# Altium project GPS_Tracker.PrjPcb
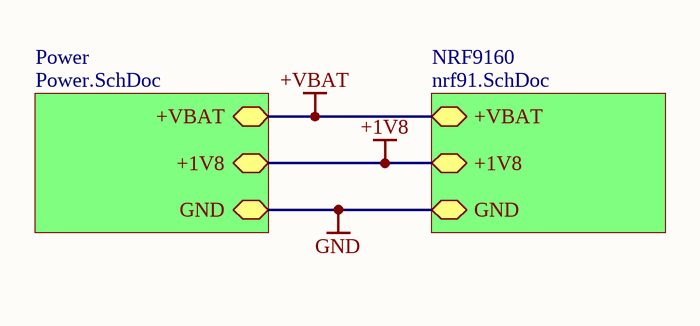
[diagram p0: Main.SchDoc]
3 sheets, 80 parts. Net scope: hierarchical (ports join the sheet entries above them; power ports are global).
Board file: GPS.PcbDoc
Sheets:
  Main.SchDoc
    NRF9160 = nrf91.SchDoc
    Power = Power.SchDoc

## Sheet Main.SchDoc: param:Title
size A4; Author: param:Autor; Wersja: param:Wersja

### Sub-sheets
NRF9160 = nrf91.SchDoc: GND (bidir), +VBAT (bidir), +1V8 (bidir)
Power = Power.SchDoc: GND (bidir), +VBAT (bidir), +1V8 (bidir)

### Nets
+1V8: sheet NRF9160/+1V8, sheet Power/+1V8
+VBAT: sheet NRF9160/+VBAT, sheet Power/+VBAT
GND: sheet NRF9160/GND, sheet Power/GND

### Notes on the sheet
- Project:
- Copyright
- ©
- AMC
- Designers:
- Subject:
- Variant:
- Data:
- Version:
- Sheet:
- /

## Sheet nrf91.SchDoc: param:Title
size A3; Author: param:Autor; Wersja: param:Wersja
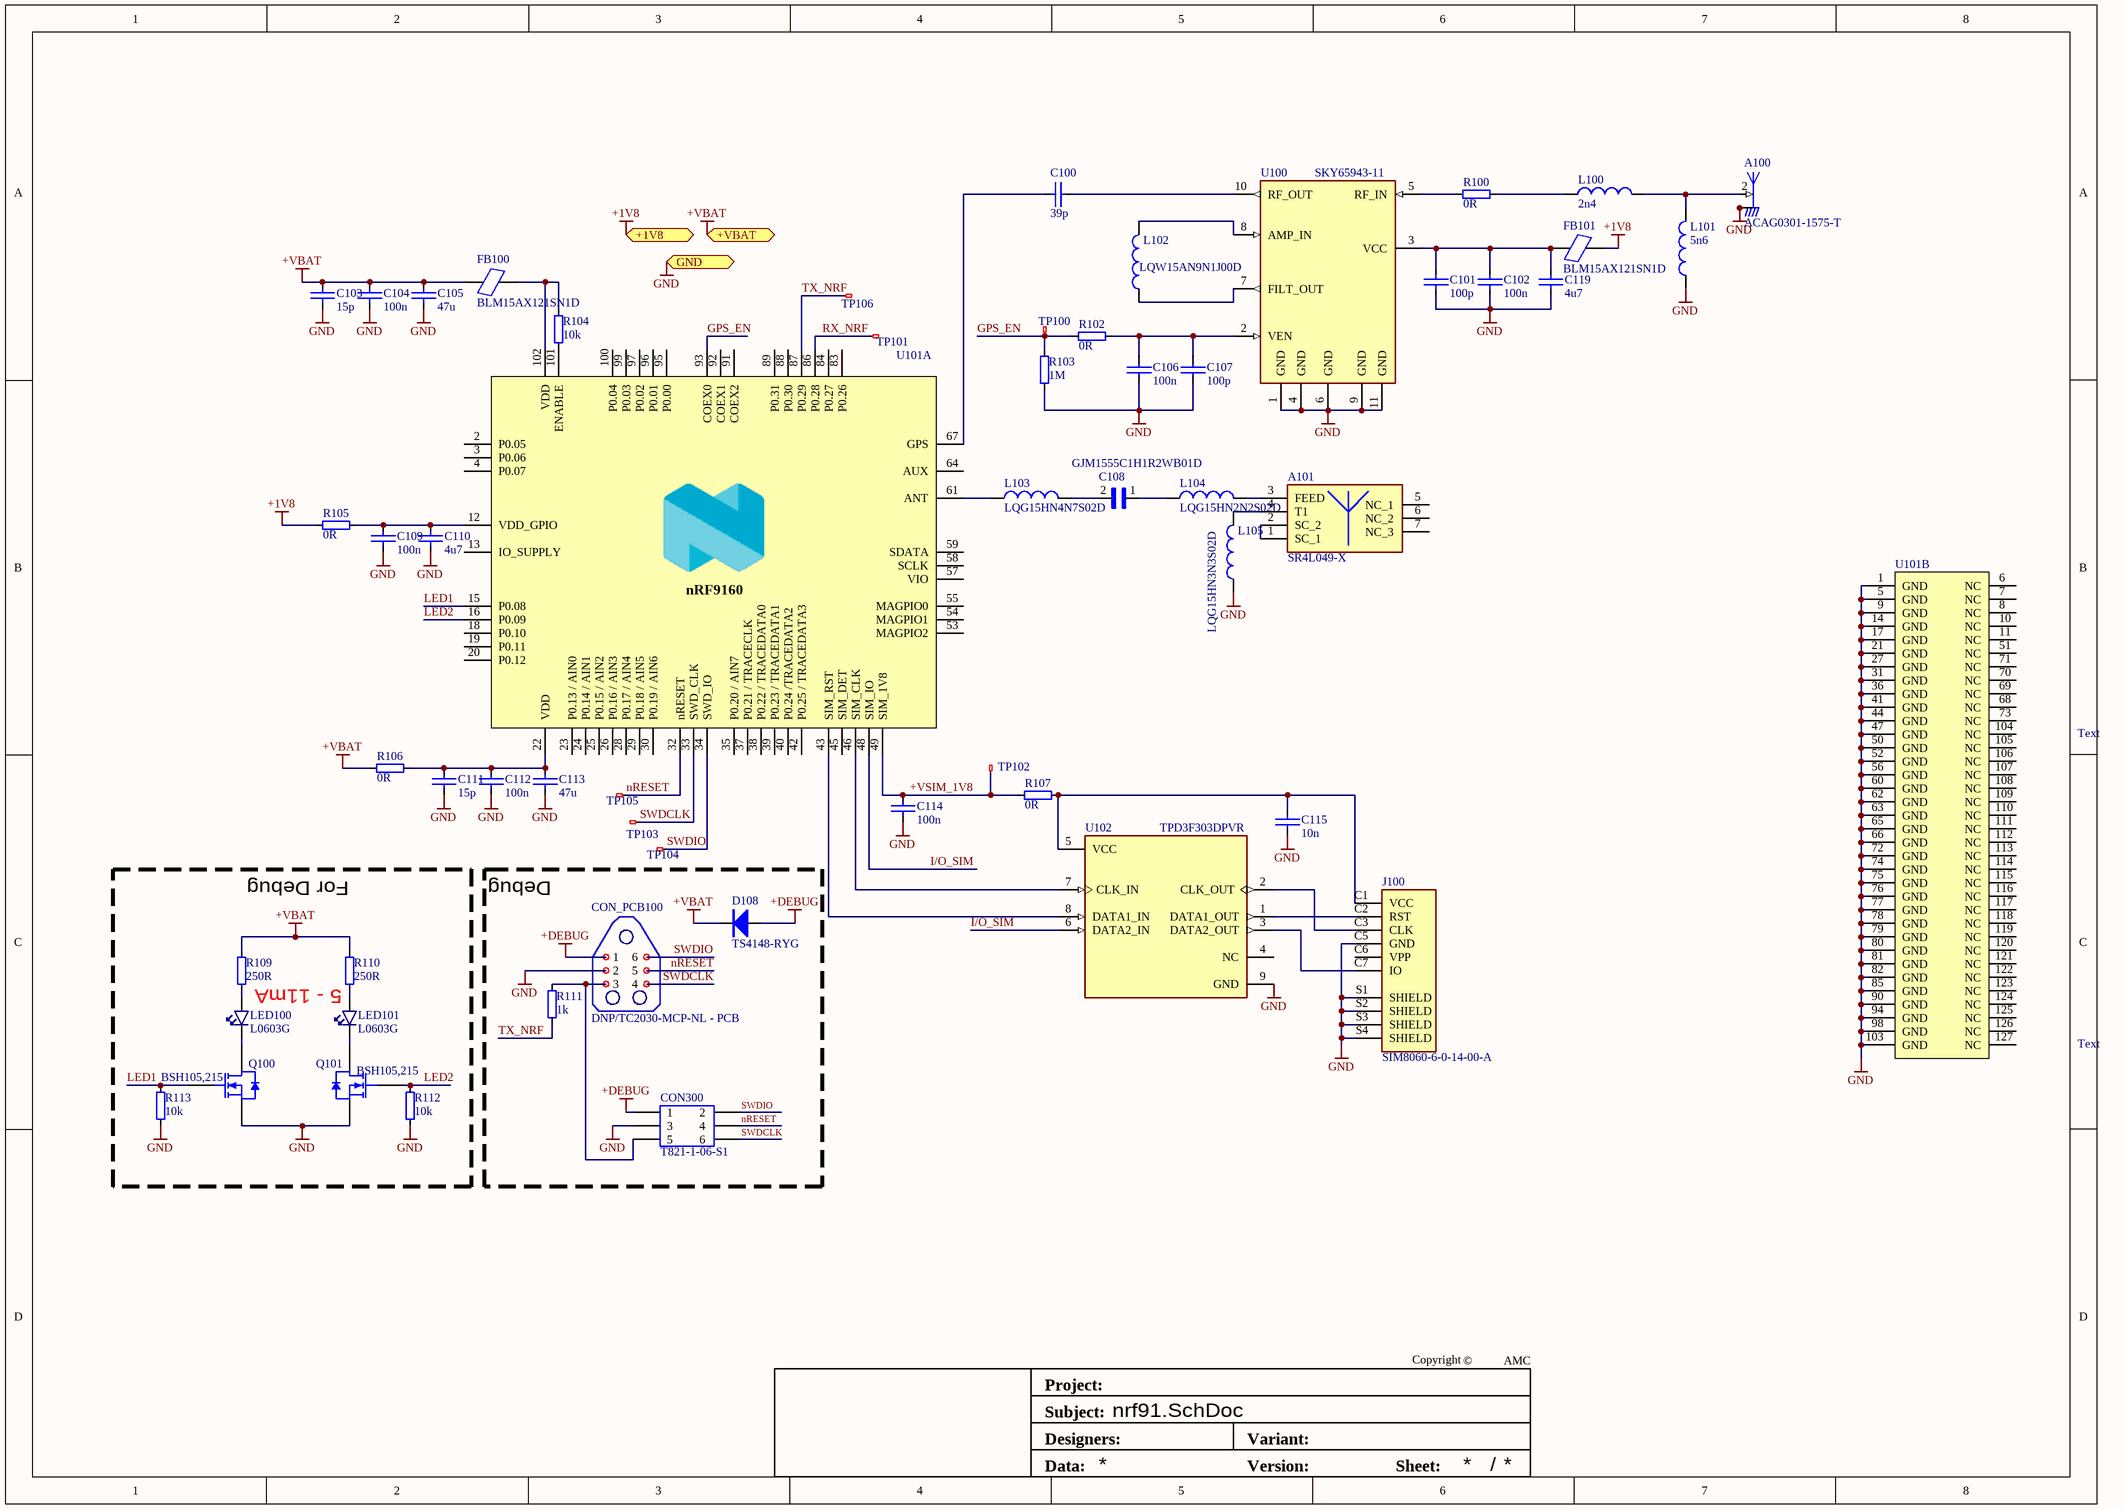
[diagram p1: nrf91.SchDoc]

### Parts
A100  ACAG0301-1575-T  [ANT_ACAG0301-1575-T]
A101  SR4L049-X  [SR4L049R]
C100  39p  [0402_C]
C101  100p  [0402_C]
C102  100n  [0402_C]
C103  15p  [0402_C]
C104  100n  [0402_C]
C105  47u  [0805_c]
C106  100n  [0402_C]
C107  100p  [0402_C]
C108  GJM1555C1H1R2WB01D  [CAPC1005X55N]
C109  100n  [0402_C]
C110  4u7  [0603_C]
C111  15p  [0402_C]
C112  100n  [0402_C]
C113  47u  [0805_c]
C114  100n  [0402_C]
C115  10n  [0402_C]
C119  4u7  [0603_C]
CON300  T821-1-06-S1  [IDC_2X3_2.54MM]
CON_PCB100  DNP/TC2030-MCP-NL - PCB  [TC2030-MCP-NL - PCB]
D108  TS4148-RYG  [0805D]
FB100  BLM15AX121SN1D  [0402_L]
FB101  BLM15AX121SN1D  [0402_L]
J100  SIM8060-6-0-14-00-A  [GCT_SIM8060-6-0-14-00-A]
L100  2n4  [0402]
L101  5n6  [0402]
L102  LQW15AN9N1J00D  [INDC1006X60N]
L103  LQG15HN4N7S02D  [INDC1005X55N]
L104  LQG15HN2N2S02D  [INDC1005X55N]
L105  LQG15HN3N3S02D  [INDC1005X55N]
LED100  L0603G  [LED_0603_G]
LED101  L0603G  [LED_0603_G]
Q100  BSH105,215  [SOT23-3D]
Q101  BSH105,215  [SOT23-3D]
R100  0R  [0402_r]
R102  0R  [0603]
R103  1M  [0603]
R104  10k  [0603]
R105  0R  [0603]
R106  0R  [0603]
R107  0R  [0603]
R109  250R  [0603]
R110  250R  [0603]
R111  1k  [0603]
R112  10k  [0603]
R113  10k  [0603]
TP100  testpointMini  [testpoint_50mils_round]  (value not drawn)
TP101  testpointMini  [testpoint_50mils_round]  (value not drawn)
TP102  testpointMini  [testpoint_50mils_round]  (value not drawn)
TP103  testpointMini  [testpoint_50mils_round]  (value not drawn)
TP104  testpointMini  [testpoint_50mils_round]  (value not drawn)
TP105  testpointMini  [testpoint_50mils_round]  (value not drawn)
TP106  testpointMini  [testpoint_50mils_round]  (value not drawn)
U100  SKY65943-11  [IC_SKY65943-11]
U101  (no value)  [nRF9160_SIP]  (parts A,B of 2)
U102  TPD3F303DPVR  [SON50P210X160X65-9N]

### Ports
+1V8 (bidir), +VBAT (bidir), GND (bidir)

### Nets
+1V8: FB101.2 R105.2 ; port +1V8
+DEBUG: CON300.1 CON_PCB100.1 D108.2
+VBAT: C103.2 C104.2 C105.2 D108.1 FB100.1 R106.2 R109.1 R110.1 ; port +VBAT
GND: A100.1 A100.3 C101.1 C102.1 C103.1 C104.1 C105.1 C106.1 C107.1 C109.1 C110.1 C111.1 C112.1 C113.1 C114.2 C115.1 C119.1 CON300.3 CON_PCB100.2 J100.C5(GND) J100.S1(SHIELD) J100.S2(SHIELD) J100.S3(SHIELD) J100.S4(SHIELD) L101.1 L105.1 Q100.2(S) Q101.2(S) R103.1 R112.2 R113.2 U100.1(GND) U100.4(GND) U100.6(GND) U100.9(GND) U100.11(GND) U101.1(GND) U101.5(GND) U101.9(GND) U101.14(GND) U101.17(GND) U101.21(GND) U101.27(GND) U101.31(GND) U101.36(GND) U101.41(GND) U101.44(GND) U101.47(GND) U101.50(GND) U101.52(GND) U101.56(GND) U101.60(GND) U101.62(GND) U101.63(GND) U101.65(GND) U101.66(GND) U101.72(GND) U101.74(GND) U101.75(GND) U101.76(GND) U101.77(GND) U101.78(GND) U101.79(GND) U101.80(GND) U101.81(GND) U101.82(GND) U101.85(GND) U101.90(GND) U101.94(GND) U101.98(GND) U101.103(GND) U102.9(GND) ; port GND
+VSIM_1V8: C114.1 R107.1 TP102.1 U101.49(SIM_1V8)
GPS_EN: R102.2 R103.2 TP100.1 U101.93(COEX0)
I/O_SIM: U101.48(SIM_IO) U102.6(DATA2_IN)
LED1: Q100.1(G) R113.1 U101.15(P0.08)
LED2: Q101.1(G) R112.1 U101.16(P0.09)
nRESET: CON300.4 CON_PCB100.5 TP105.1 U101.32(nRESET)
RX_NRF: TP101.1 U101.86(P0.28)
SWDCLK: CON300.6 CON_PCB100.4 TP103.1 U101.33(SWD_CLK)
SWDIO: CON300.2 CON_PCB100.6 TP104.1 U101.34(SWD_IO)
TX_NRF: R111.1 TP106.1 U101.87(P0.29)
NetA100_2: A100.2 L100.2 L101.2
NetA101_1: A101.1(SC_1) A101.2(SC_2)
NetA101_3: A101.3(FEED) L104.2
NetA101_4: A101.4(T1) L105.2
NetC100_1: C100.1 U100.10(RF_OUT)
NetC100_2: C100.2 U101.67(GPS)
NetC101_2: C101.2 C102.2 C119.2 FB101.1 U100.3(VCC)
NetC106_2: C106.2 C107.2 R102.1 U100.2(VEN)
NetC108_1: C108.1 L104.1
NetC108_2: C108.2 L103.2
NetC109_2: C109.2 C110.2 R105.1 U101.12(VDD_GPIO)
NetC111_2: C111.2 C112.2 C113.2 R106.1 U101.22(VDD)
NetC115_2: C115.2 J100.C1(VCC) R107.2 U102.5(VCC)
NetCON300_5: CON300.5 CON_PCB100.3 R111.2
NetFB100_2: FB100.2 R104.2 U101.102(VDD)
NetJ100_C2: J100.C2(RST) U102.1(DATA1_OUT)
NetJ100_C3: J100.C3(CLK) U102.2(CLK_OUT)
NetJ100_C7: J100.C7(IO) U102.3(DATA2_OUT)
NetL100_1: L100.1 R100.1
NetL102_1: L102.1 U100.7(FILT_OUT)
NetL102_2: L102.2 U100.8(AMP_IN)
NetL103_1: L103.1 U101.61(ANT)
NetLED100_1: LED100.1(C) Q100.3(D)
NetLED100_2: LED100.2(A) R109.2
NetLED101_1: LED101.1(C) Q101.3(D)
NetLED101_2: LED101.2(A) R110.2
NetR100_2: R100.2 U100.5(RF_IN)
NetR104_1: R104.1 U101.101(ENABLE)
NetU101_43: U101.43(SIM_RST) U102.8(DATA1_IN)
NetU101_46: U101.46(SIM_CLK) U102.7(CLK_IN)

Not connected (* = marked no-connect by the designer): A101 5(NC_1) 6(NC_2) 7(NC_3); J100 C6(VPP); U101 2(P0.05) 3(P0.06) 4(P0.07) 6(NC) 7(NC) 8(NC) 10(NC) 11(NC) 13(IO_SUPPLY) 18(P0.10) 19(P0.11) 20(P0.12) 23(P0.13_/_AIN0) 24(P0.14_/_AIN1) 25(P0.15_/_AIN2) 26(P0.16_/_AIN3) 28(P0.17_/_AIN4) 29(P0.18_/_AIN5) 30(P0.19_/_AIN6) 35(P0.20_/_AIN7) 37(P0.21_/_TRACECLK) 38(P0.22_/_TRACEDATA0) 39(P0.23_/_TRACEDATA1) 40(P0.24_/TRACEDATA2) 42(P0.25_/_TRACEDATA3) 45(SIM_DET) 51(NC) 53(MAGPIO2) 54(MAGPIO1) 55(MAGPIO0) 57(VIO) 58(SCLK) 59(SDATA) 64(AUX) 68(NC) 69(NC) 70(NC) 71(NC) 73(NC) 83(P0.26) 84(P0.27) 88(P0.30) 89(P0.31) 91(COEX2) 92(COEX1) 95(P0.00) 96(P0.01) 97(P0.02) 99(P0.03) 100(P0.04) 104(NC) 105(NC) 106(NC) 107(NC) 108(NC) 109(NC) 110(NC) 111(NC) 112(NC) 113(NC) 114(NC) 115(NC) 116(NC) 117(NC) 118(NC) 119(NC) 120(NC) 121(NC) 122(NC) 123(NC) 124(NC) 125(NC) 126(NC) 127(NC); U102 4(NC)

### Notes on the sheet
- Text
- For Debug
- Debug
- 5 - 11mA
- Project:
- Copyright
- ©
- AMC
- Designers:
- Subject:
- Variant:
- Data:
- Version:
- Sheet:
- /
- (in symbol nRF9160_SIP, part A) nRF9160

### Library data of the parts
A100 = ACAG0301-1575-T: 1.575GHz GPS Chip RF Antenna 1.565GHz ~ 1.585GHz 4.18dBi Solder Surface Mount; MF: Abracon LLC; MP: ACAG0301-1575-T; SnapEDA_Link: https://www.snapeda.com/parts/ACAG0301-1575-T/Abracon%20LLC/view-part/3077605/?ref=snap; Check_prices: https://www.snapeda.com/parts/ACAG0301-1575-T/Abracon%20LLC/view-part/3077605/?ref=eda; Price: None; Availability: In Stock; Purchase-URL: https://pricing.snapeda.com/search/part/ACAG0301-1575-T/?ref=eda; Package: None; Value: *
A101 = SR4L049-X: Antenna; Manufacturer_Name: Antenova; Manufacturer_Part_Number: SR4L049-R; Datasheet Link: https://componentsearchengine.com/Datasheets/1/SR4L049-R.pdf; Height: 3.4mm
C100-C107 C109-C115 C119 = CAP: Capacitor
CON300 = piny_2x3: idc-pionowe: maritex: bh06s , tme: ZL231-6PG
CON_PCB100 = TC2030-MCP-NL - PCB
D108 = DIODE
FB100 FB101 = Ferrite_Bead: Ferrite Bead
J100 = SIM8060-6-0-14-00-A: 6 Position Card Connector NANO SIM Surface Mount, Right Angle Gold; MF: Global Connector Technology; MP: SIM8060-6-0-14-00-A; Package: Package Analog Devices; Price: None; Availability: Unavailable; SnapEDA_Link: https://www.snapeda.com/parts/SIM8060-6-0-14-00-A/Global%20Connector%20Technology/view-part/3214904/?ref=snap; Value: *
L100 L101 = Inductor
L102 = LQW15AN9N1J00D: Inductor with Inductance: 9.1nH Tol. +/-5%, Package: 0402 (1005); MF: Murata; Value: *; SnapEDA_Link: https://www.snapeda.com/parts/LQW15AN9N1J00D/Murata+Electronics+North+America/view-part/?ref=snap; Check_prices: https://www.snapeda.com/parts/LQW15AN9N1J00D/Murata+Electronics+North+America/view-part/?ref=eda; Purchase-URL: https://pricing.snapeda.com/search/part/LQW15AN9N1J00D/?ref=eda; Availability: In Stock; Price: None; Package: 1006 Murata; MP: LQW15AN9N1J00D
L103 = LQG15HN4N7S02D: Ind RF Chip Multi-Layer 2.2nH 0.3nH 100MHz 8Q-Factor Air 300mA 0402 Paper T/R; MP: LQG15HN2N2S02D; Package: None; Price: None; Value: *; Availability: Unavailable
L104 = LQG15HN2N2S02D: Ind RF Chip Multi-Layer 2.2nH 0.3nH 100MHz 8Q-Factor Air 300mA 0402 Paper T/R; Package: None; Price: None; Value: *; MP: LQG15HN2N2S02D; Availability: Unavailable
L105 = LQG15HN3N3S02D: Ind RF Chip Multi-Layer 2.2nH 0.3nH 100MHz 8Q-Factor Air 300mA 0402 Paper T/R; MP: LQG15HN2N2S02D; Package: None; Price: None; Value: *; Availability: Unavailable
LED100 LED101 = D:LED: LED, Green, 0603, 573nm, Vf=2.0V, 24mcd, - 40 to +85°C; Part Number: VS 25C7M5; Manufacturer: Victory Electronics; Artikkelnr Noca: N.A.; Manufacturer Part Number: VS 25C7M5; Datasheet: \\hizz\pro\app9717\Datasheet\optoelectronics\Victory Electronics\VS 25C7M5.pdf; Footprint Doc: 0603; LatestRevisionDate: 2017-08-21; Pin Count: 2; Publisher: Nordic Semiconductor; Published: 2017-08-21; Value: L0603G; Note: *; Supplier: EC Partner; Supplier part number: *; 2nd source Supplier: *; 2nd source part number: *; Artikkelnr Simpro: N.A.
Q100 Q101 = BSS123_MN: MOSFET N-CH, 170V, 6Ohm, 170mA, Single
R100 R102-R107 R109-R113 = RES
  R100 R102 R105-R107: Value: 0R
  R103: Value: 1M
  R104 R112 R113: Value: 10k
  R109 R110: Value: 250R
  R111: Value: 1k
U100 = SKY65943-11: RF Front End 1.559GHz ~ 1.606GHz Galileo, GLONASS, GNSS, GPS 10-MCM (2.5x2.5); MF: Skyworks Solutions Inc.; Check_prices: https://www.snapeda.com/parts/SKY65943-11/Skyworks%20Solutions%20Inc./view-part/3740345/?ref=eda; Availability: Warning; Price: None; Package: SMD-10 Skyworks Solutions Inc.; MP: SKY65943-11; Value: *; SnapEDA_Link: https://www.snapeda.com/parts/SKY65943-11/Skyworks%20Solutions%20Inc./view-part/3740345/?ref=snap; Purchase-URL: https://pricing.snapeda.com/search/part/SKY65943-11/?ref=eda
U101 = nRF9160_SIP
U102 = TPD3F303DPVR: None <a href="https://snapeda.com/parts/TPD3F303DPVR/Texas%20Instruments/view-part/?ref=eda">Check prices</a>; Price: None; Package: None; Availability: Unavailable; MP: TPD3F303DPVR; Value: *
C108 = GJM1555C1H1R2WB01D: Package: None; Price: None; Value: *; MP: GJM1555C1H1R2WB01D; Availability: Unavailable
TP100-TP106 = testpointMini: Net: =NetName

## Sheet Power.SchDoc: param:Title
size A4; Author: param:Autor; Wersja: param:Wersja
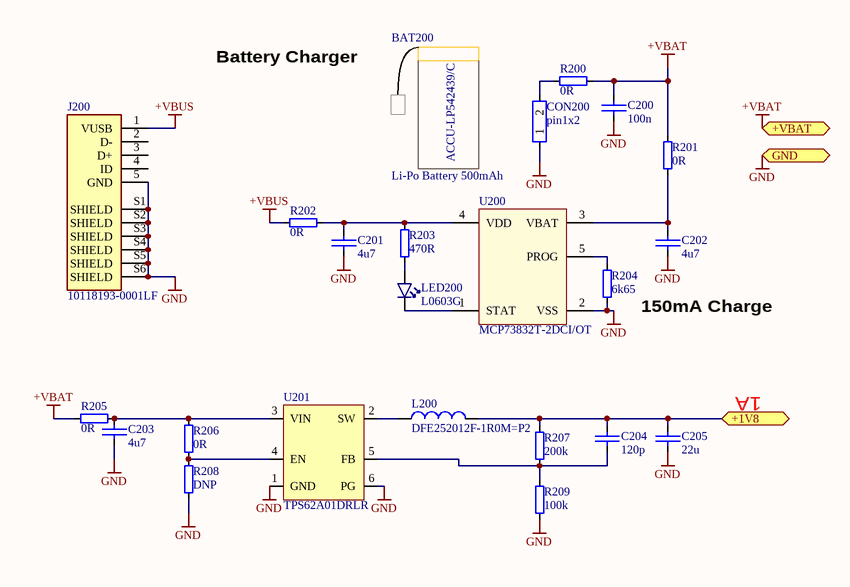
[diagram p2: Power.SchDoc]

### Parts
BAT200  Li-Po Battery 500mAh  [Battery 500maH]
C200  100n  [0402_C]
C201  4u7  [0603_C]
C202  4u7  [0603_C]
C203  4u7  [0603_C]
C204  120p  [0402_C]
C205  22u  [0805_c]
CON200  pin1x2  [piny1x2]
J200  10118193-0001LF  [FCI_10118193-0001LF]
L200  DFE252012F-1R0M=P2  [INDC2520X120N]
LED200  L0603G  [LED_0603_G]
R200  0R  [0603]
R201  0R  [0603]
R202  0R  [0603]
R203  470R  [0603]
R204  6k65  [0603]
R205  0R  [0603]
R206  0R  [0603]
R207  200k  [0603]
R208  DNP  [0603]
R209  100k  [0603]
U200  MCP73832T-2DCI/OT  [SOT95P280X145-5N]
U201  TPS62A01DRLR  [TPS62A01DRLR]

### Ports
+1V8 (bidir), +VBAT (bidir), GND (bidir)

### Nets
+1V8: C204.2 C205.2 L200.2 R207.1 ; port +1V8
+VBAT: C200.2 R200.1 R201.1 R205.2 ; port +VBAT
+VBUS: J200.1(VUSB) R202.2
GND: C200.1 C201.1 C202.1 C203.1 C205.1 CON200.1 J200.5(GND) J200.S1(SHIELD) J200.S2(SHIELD) J200.S3(SHIELD) J200.S4(SHIELD) J200.S5(SHIELD) J200.S6(SHIELD) R204.2 R208.2 R209.2 U200.2(VSS) U201.1(GND) U201.6(PG) ; port GND
NetC201_2: C201.2 R202.1 R203.1 U200.4(VDD)
NetC202_2: C202.2 R201.2 U200.3(VBAT)
NetC203_2: C203.2 R205.1 R206.1 U201.3(VIN)
NetC204_1: C204.1 R207.2 R209.1 U201.5(FB)
NetCON200_2: CON200.2 R200.2
NetL200_1: L200.1 U201.2(SW)
NetLED200_1: LED200.1(C) U200.1(STAT)
NetLED200_2: LED200.2(A) R203.2
NetR204_1: R204.1 U200.5(PROG)
NetR206_2: R206.2 R208.1 U201.4(EN)

Not connected (* = marked no-connect by the designer): J200 2(D-) 3(D+) 4(ID)

### Notes on the sheet
- Battery Charger
- ACCU-LP542439/C
- 150mA Charge
- 1A
- Project:
- Copyright
- ©
- AMC
- Designers:
- Subject:
- Variant:
- Data:
- Version:
- Sheet:
- /

### Library data of the parts
BAT200 = Li-Po Battery 500mAh: ACCU-LP542439/C
C200-C205 = CAP: Capacitor
CON200 = pin1x2: 1x2
J200 = 10118193-0001LF: USB - micro B USB 2.0 Receptacle Connector 5 Position Surface Mount, Right Angle; Through Hole; MF: Amphenol ICC; Availability: Unavailable; SnapEDA_Link: https://www.snapeda.com/parts/10118193-0001LF/Amphenol%20FCI/view-part/2758989/?ref=snap; MP: 10118193-0001LF; Price: None; Value: *; Package: None
L200 = DFE252012F-1R0M=P2: Inductor with Inductance: 1uH Tol. +/-20%, Package: 1008 _2520_; MF: Murata Electronics; MP: DFE252012F-1R0M=P2; Package: 2520 Murata; SnapEDA_Link: https://www.snapeda.com/parts/DFE252012F-1R0M%3DP2/Murata%20Electronics%20North%20America/view-part/1498728/?ref=snap; Digi-Key_Purchase_URL: https://www.digikey.ru/product-detail/en/murata-electronics/DFE252012F-1R0M=P2/490-13053-1-ND/5812765?utm_source=snapeda&utm_medium=aggregator&utm_campaign=symbol; Value: *; Digi-Key_Part_Number: 490-13053-1-ND
LED200 = D:LED: as LED100 on sheet nrf91; Manufacturer Part Number: VS 25C7M5; Datasheet: \\hizz\pro\app9717\Datasheet\optoelectronics\Victory Electronics\VS 25C7M5.pdf; Footprint Doc: 0603; LatestRevisionDate: 2017-08-21; Pin Count: 2; Publisher: Nordic Semiconductor; Published: 2017-08-21; Value: L0603G; Note: *; Supplier: EC Partner; Supplier part number: *; 2nd source Supplier: *; 2nd source part number: *; Artikkelnr Simpro: N.A.
R200-R209 = RES
  R200-R202 R205 R206: Value: 0R
  R203: Value: 470R
  R204: Value: 6k65
  R207: Value: 200k
  R208: Value: DNP
  R209: Value: 100k
U200 = MCP73832T-2DCI/OT: Charger IC Lithium Ion/Polymer SOT-23-5; MF: Microchip; SnapEDA_Link: https://www.snapeda.com/parts/MCP73832T-2DCI/OT/Microchip/view-part/45011/?ref=snap; Mouser-Purchase-URL: https://snapeda.com/shop?store=Mouser&id=45011; Availability: Warning; MP: MCP73832T-2DCI/OT; Package: SOT-23 Microchip; Value: *; Price: None

## Nets that join several sheets
+1V8: nrf91 (FB101.2 R105.2), Power (C204.2 C205.2 L200.2 R207.1)
+VBAT: nrf91 (8 pins), Power (C200.2 R200.1 R201.1 R205.2)
GND: nrf91 (72 pins), Power (19 pins)